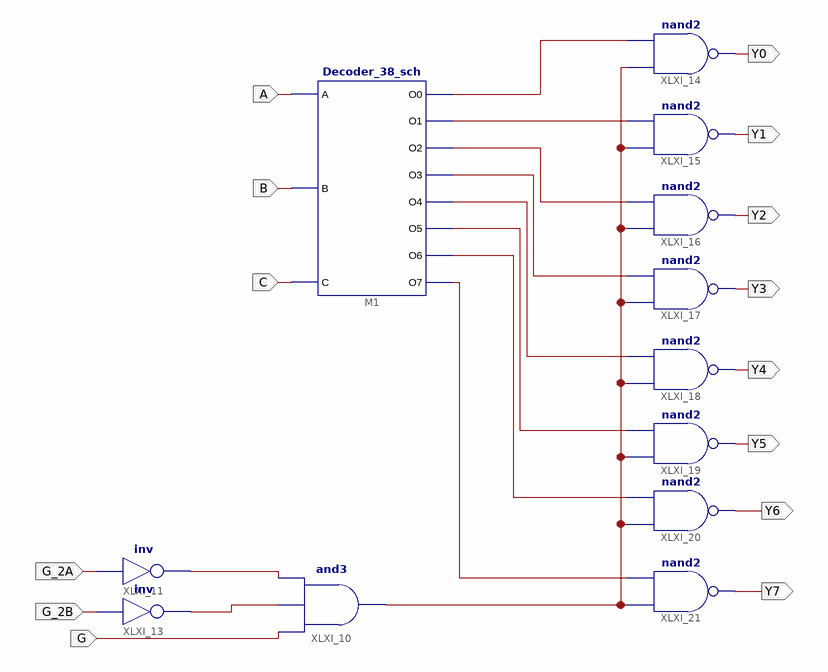
[diagram p0: schematic sheet 1]
// Xilinx ISE schematic HTC138.sch (kintex7) as structural Verilog: 12 symbols, 14 ports
module HTC138 (
  input  G,
  input  G_2A,
  input  G_2B,
  input  A,
  input  B,
  input  C,
  output Y1,
  output Y2,
  output Y3,
  output Y4,
  output Y5,
  output Y6,
  output Y7,
  output Y0
);

  wire XLXN_1, XLXN_2, XLXN_3, XLXN_4, XLXN_5, XLXN_6, XLXN_7, XLXN_8, XLXN_16, XLXN_17, XLXN_32;

  Decoder_38_sch M1 (
    .A(A), .B(B), .C(C), .O0(XLXN_1), .O1(XLXN_2), .O2(XLXN_3), .O3(XLXN_4), .O4(XLXN_5), .O5(XLXN_6),
    .O6(XLXN_7), .O7(XLXN_8));
  and XLXI_10 (XLXN_32, G, XLXN_17, XLXN_16);
  not XLXI_11 (XLXN_16, G_2A);
  not XLXI_13 (XLXN_17, G_2B);
  nand XLXI_14 (Y0, XLXN_32, XLXN_1);
  nand XLXI_15 (Y1, XLXN_32, XLXN_2);
  nand XLXI_16 (Y2, XLXN_32, XLXN_3);
  nand XLXI_17 (Y3, XLXN_32, XLXN_4);
  nand XLXI_18 (Y4, XLXN_32, XLXN_5);
  nand XLXI_19 (Y5, XLXN_32, XLXN_6);
  nand XLXI_20 (Y6, XLXN_32, XLXN_7);
  nand XLXI_21 (Y7, XLXN_32, XLXN_8);
endmodule
